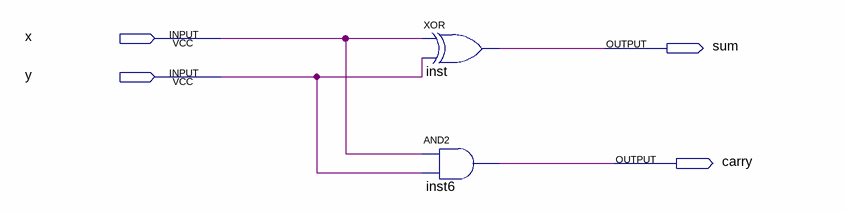
[diagram p0: schematic sheet]
// Quartus schematic HA.bdf as structural Verilog: 2 symbols, 4 pins
module HA (
  input  x,
  input  y,
  output sum,
  output carry
);

  xor inst (sum, x, y);
  and inst6 (carry, x, y);
endmodule
